# Altium schematic sheet dac-ldo.SchDoc: DAC - LDOs
size Letter; CheckedBy: J. Brinton; CompanyName: Signal Laboratories, Inc.; DrawnBy: J. Brinton; Engineer: J. Brinton; Address1: 3479 Edison Way; Address2: Menlo Park CA 94025; Address3: +1 (877) 778-8435; Address4: siglabs.com; Revision: 3; SheetNumber: 28; SheetTotal: 49
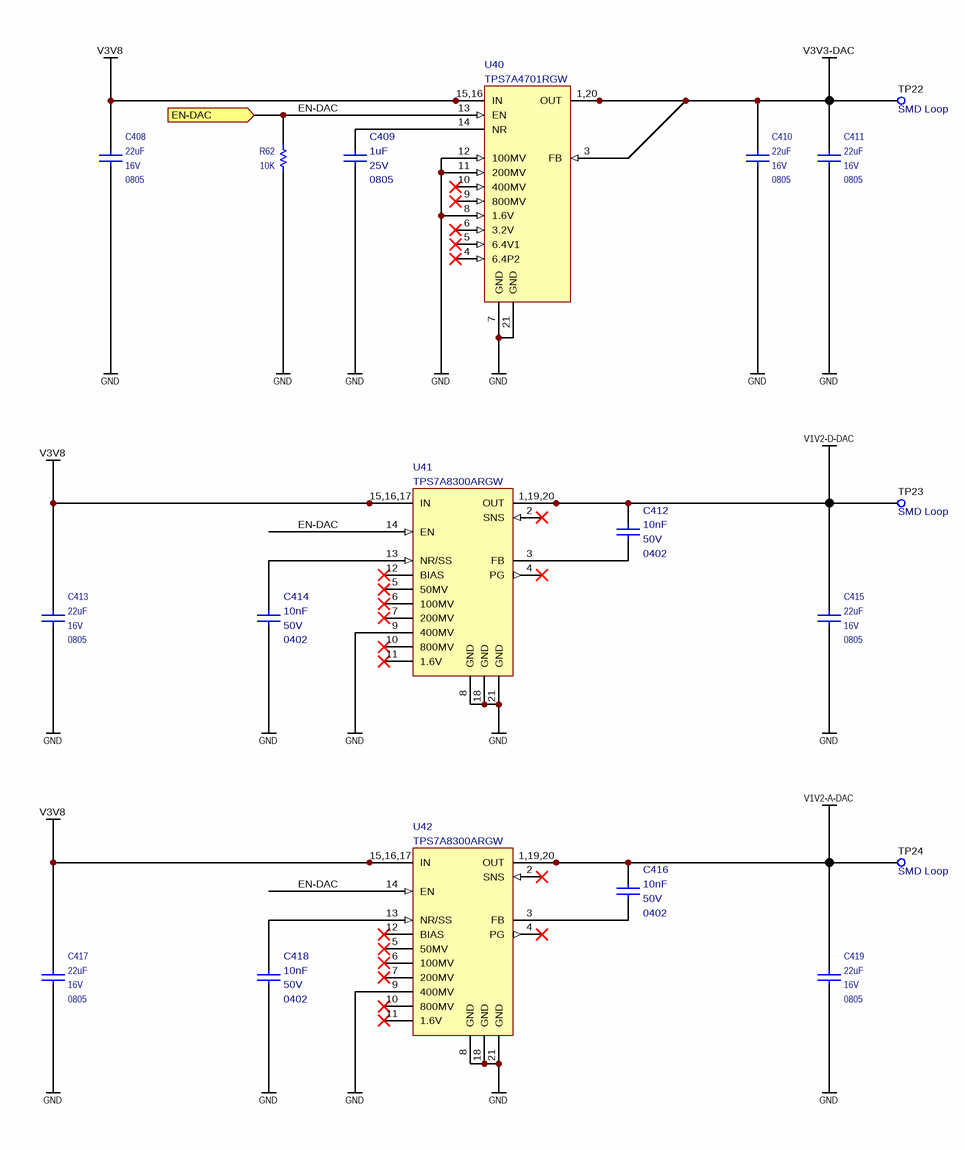
[diagram p0: dac-ldo.SchDoc]

## Parts
C408  value 22uF  Voltage: 16V  Package: 0805  [CAPC200X125X145L45N]  (hidden comment: CL21A226KOQNNNE)
C409  value 1uF  Package: 0805  Voltage: 25V  [CAPC200X125X145L45N]  (hidden comment: TMK212B7105KG)
C410  value 22uF  Voltage: 16V  Package: 0805  [CAPC200X125X145L45N]  (hidden comment: CL21A226KOQNNNE)
C411  value 22uF  Voltage: 16V  Package: 0805  [CAPC200X125X145L45N]  (hidden comment: CL21A226KOQNNNE)
C412  value 10nF  Package: 0402  Voltage: 50V  [CAPC100X50X55L25N]  (hidden comment: GRM155R71H103KA88)
C413  value 22uF  Voltage: 16V  Package: 0805  [CAPC200X125X145L45N]  (hidden comment: CL21A226KOQNNNE)
C414  value 10nF  Package: 0402  Voltage: 50V  [CAPC100X50X55L25N]  (hidden comment: GRM155R71H103KA88)
C415  value 22uF  Voltage: 16V  Package: 0805  [CAPC200X125X145L45N]  (hidden comment: CL21A226KOQNNNE)
C416  value 10nF  Package: 0402  Voltage: 50V  [CAPC100X50X55L25N]  (hidden comment: GRM155R71H103KA88)
C417  value 22uF  Voltage: 16V  Package: 0805  [CAPC200X125X145L45N]  (hidden comment: CL21A226KOQNNNE)
C418  value 10nF  Package: 0402  Voltage: 50V  [CAPC100X50X55L25N]  (hidden comment: GRM155R71H103KA88)
C419  value 22uF  Voltage: 16V  Package: 0805  [CAPC200X125X145L45N]  (hidden comment: CL21A226KOQNNNE)
R62  value 10K  [RESC1005X40N]  (hidden comment: ERJ-2RKF1002X)
TP22  Notes: SMD Loop  [5015]  (hidden comment: 5015)
TP23  Notes: SMD Loop  [5015]  (hidden comment: 5015)
TP24  Notes: SMD Loop  [5015]  (hidden comment: 5015)
U40  TPS7A4701RGW  [QFN65P500X500X100-21N]
U41  TPS7A8300ARGW  [QFN65P500X500X100-21N]
U42  TPS7A8300ARGW  [QFN65P500X500X100-21N]

## Ports
EN-DAC (in)

## Nets
GND: C408.1 C409.2 C410.1 C411.1 C413.1 C414.2 C415.1 C417.1 C418.2 C419.1 R62.2 U40.7(GND) U40.8(1.6V) U40.11(200MV) U40.12(100MV) U40.21(GND) U41.8(GND) U41.9(400MV) U41.18(GND) U41.21(GND) U42.8(GND) U42.9(400MV) U42.18(GND) U42.21(GND)
V1V2-A-DAC: C416.1 C419.2 TP24.1 U42.1(OUT) U42.19(OUT) U42.20(OUT)
V1V2-D-DAC: C412.1 C415.2 TP23.1 U41.1(OUT) U41.19(OUT) U41.20(OUT)
V3V3-DAC: C410.2 C411.2 TP22.1 U40.1(OUT) U40.3(FB) U40.20(OUT)
V3V8: C408.2 C413.2 C417.2 U40.15(IN) U40.16(IN) U41.15(IN) U41.16(IN) U41.17(IN) U42.15(IN) U42.16(IN) U42.17(IN)
EN-DAC: R62.1 U40.13(EN) U41.14(EN) U42.14(EN) ; port EN-DAC
NetC409_1: C409.1 U40.14(NR)
NetC412_2: C412.2 U41.3(FB)
NetC414_1: C414.1 U41.13(NR/SS)
NetC416_2: C416.2 U42.3(FB)
NetC418_1: C418.1 U42.13(NR/SS)

Not connected (* = marked no-connect by the designer): U40 4(6.4P2)* 5(6.4V1)* 6(3.2V)* 9(800MV)* 10(400MV)*; U41 2(SNS)* 4(PG)* 5(50MV)* 6(100MV)* 7(200MV)* 10(800MV)* 11(1.6V)* 12(BIAS)*; U42 2(SNS)* 4(PG)* 5(50MV)* 6(100MV)* 7(200MV)* 10(800MV)* 11(1.6V)* 12(BIAS)*

## Notes on the sheet
- Title
- Engineer
- Revision
- Drawn By
- Checked By
- Date
- Sheet
- of
- (in symbol TPS7A4701RGW_1) 15,16; 1,20
- (in symbol TPS7A8300ARGW) 15,16,17; 1,19,20

## Library data of the parts
C408 C410 C411 C413 C415 C417 C419 = CAP 0603: Ceramic Capacitor 22uF ±10% 16V X5R 0805; Manufacturer: Samsung; Tr: -55:85; Manufacturer P/N: CL21A226KOQNNNE; Tolerance: ±10%
C409 = TMK212B7105KG: Ceramic Capacitor 1uF ±10% 25V X7R 0805; Manufacturer: Taiyo Yuden; Manufacturer P/N: TMK212B7105KG; Tolerance: ±10%; Tr: *
C412 C414 C416 C418 = TMK105B7103KV: Ceramic Capacitor 10nF ±10% 50V X7R 0402; Manufacturer: Murata; Tr: -55:125; Manufacturer P/N: GRM155R71H103KA88; Tolerance: ±10%
R62 = RES 0402: Thick Film Resistor 10k ±1% 0.1W 50V 0402; Manufacturer: Panasonic; Tr: -55:155; Package: 0402; Manufacturer P/N: ERJ-2RKF1002X; Tolerance: ±1%
TP22-TP24 = TEST_POINT_SMD_50: Test Point SMD; Manufacturer: Keystone; Manufacturer P/N: 5015
U40 = TPS7A4701RGW_1: Low-Dropout Linear Regulator 20-VQFN; Manufacturer: Texas Instruments; Manufacturer P/N: TPS7A4701RGW; Package: VQFN-20
U41 U42 = TPS7A8300ARGW: LDO Regulator, 2A, VQFN-20; Manufacturer: Texas Instruments; Package: VQFN-20; Manufacturer P/N: TPS7A8300ARGW